# Altium schematic sheet SPI LVDS Peripheral.SchDoc: SPI LVDS Peripheral Board
size 279 x 215 mm; Engineer: JGao; Organization: TESLA Motors, INC; Address1: 3500 Deer Creek Road; Address2: Palo Alto, CA; Address4: U.S.A.; SheetNumber: 1; SheetTotal: 1
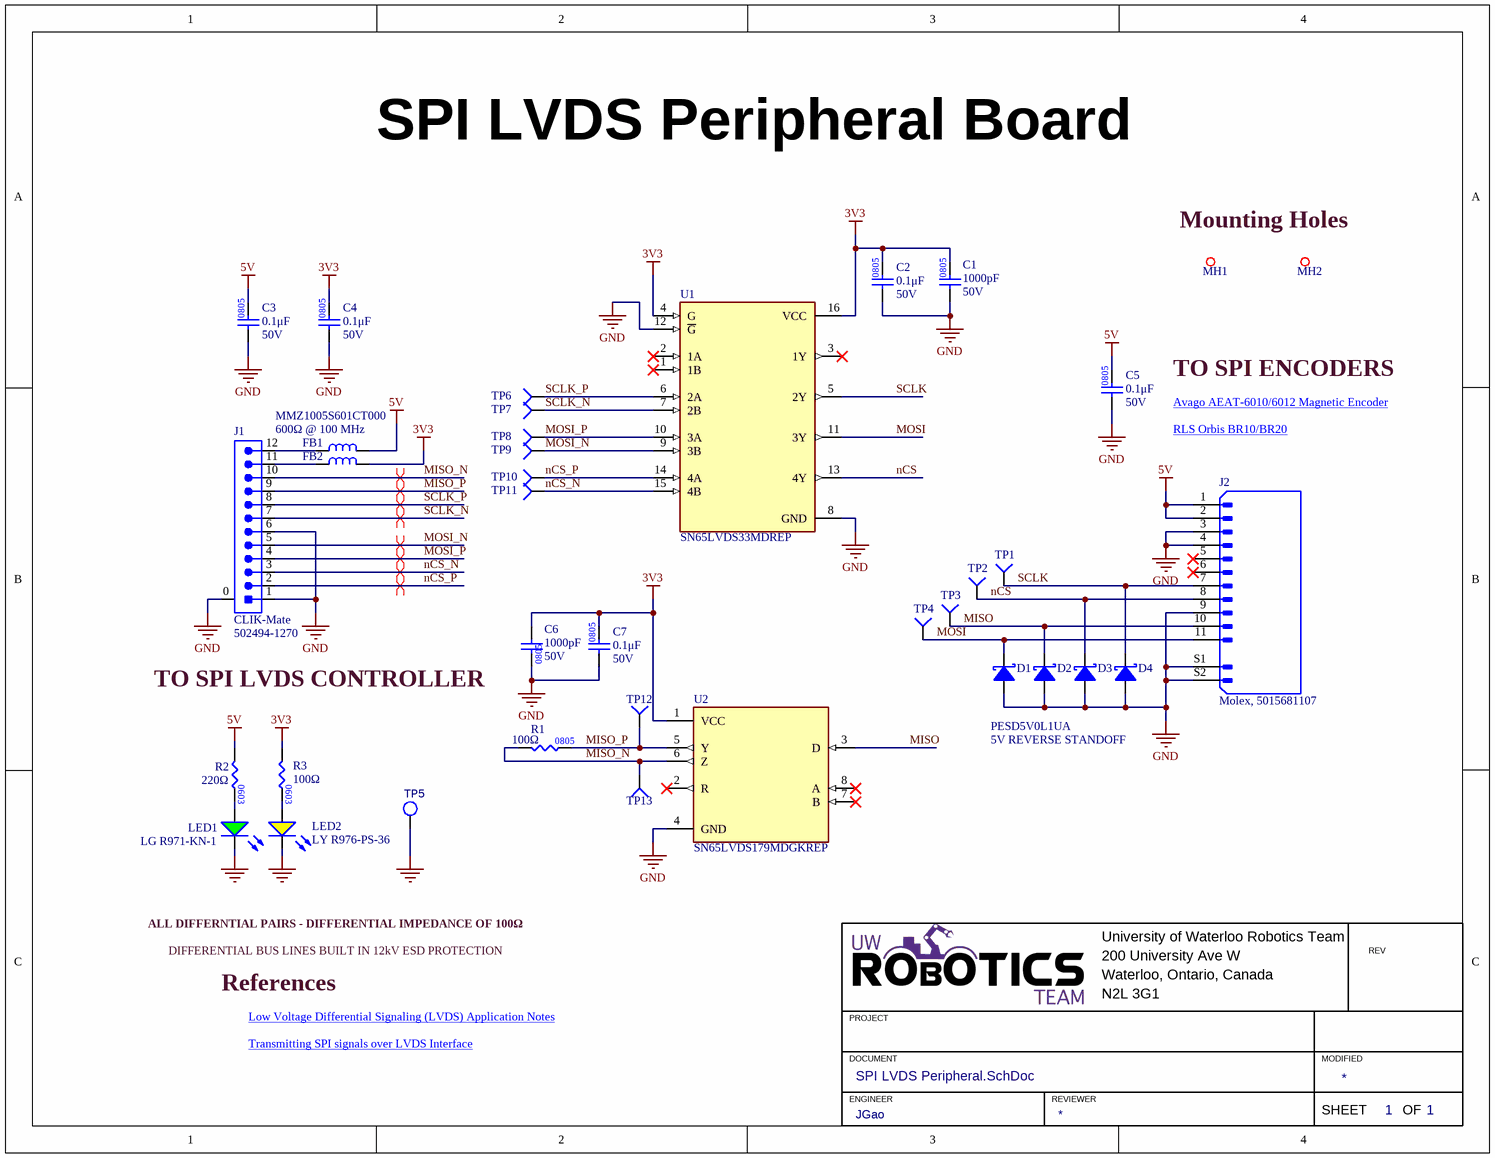
[diagram p0: SPI LVDS Peripheral.SchDoc]

## Parts
C1  value 1000pF  Voltage Rating: 50V  [CAP2012]  (hidden comment: CAP_1000pF_50V_0805)
C2  value 0.1μF  Voltage Rating: 50V  [CAP2012]  (hidden comment: CAP_0.1uF_50V_0805)
C3  value 0.1μF  Voltage Rating: 50V  [CAP2012]  (hidden comment: CAP_0.1uF_50V_0805)
C4  value 0.1μF  Voltage Rating: 50V  [CAP2012]  (hidden comment: CAP_0.1uF_50V_0805)
C5  value 0.1μF  Voltage Rating: 50V  [CAP2012]  (hidden comment: CAP_0.1uF_50V_0805)
C6  value 1000pF  Voltage Rating: 50V  [CAP2012]  (hidden comment: CAP_1000pF_50V_0805)
C7  value 0.1μF  Voltage Rating: 50V  [CAP2012]  (hidden comment: CAP_0.1uF_50V_0805)
D1  Manufacturer Part Number 1: PESD5V0L1UA  [SOD-323]  (hidden comment: TVS_DIODE_UNIDIR_5V)
D2  TVS_DIODE_UNIDIR_5V  [SOD-323]  (value not drawn)
D3  TVS_DIODE_UNIDIR_5V  [SOD-323]  (value not drawn)
D4  TVS_DIODE_UNIDIR_5V  [SOD-323]  (value not drawn)
FB1  Manufacturer Part Number 1: MMZ1005S601CT000  Impedance @ Frequency: 600Ω @ 100 MHz  [RES0402]  (hidden comment: FERRITE_BEAD_600OHM_0402)
FB2  FERRITE_BEAD_600OHM_0402  [RES0402]  (value not drawn)
J1  Family: CLIK-Mate  Supplier Part Number 1: 502494-1270  [MOLEX-5024941270]  (hidden comment: CON_12M_SM_RA_2mm)
J2  MP: Molex, 5015681107  [MOLEX-5015681107]  (hidden comment: CON_12M_SM_RA)
LED1  Manufacturer Part Number 1: LG R971-KN-1  [LED_0805_GREEN]  (hidden comment: LED_GREEN)
LED2  Manufacturer Part Number 1: LY R976-PS-36  [LED_0805_YELLOW]  (hidden comment: LED_YELLOW)
MH1  MOUNTING_HOLE_M3  [MOUNTING_HOLE_3mm]  (value not drawn)  (no BOM)
MH2  MOUNTING_HOLE_M3  [MOUNTING_HOLE_3mm]  (value not drawn)  (no BOM)
R1  value 100Ω  [RES0805]  (hidden comment: RES_100Ω_0805_1%)
R2  value 220Ω  [RES0603]  (hidden comment: RES_220Ω_0603_5%)
R3  value 100Ω  [RES0603]  (hidden comment: RES_100Ω_0603_1%)
TP1  TESTPOINT_1MM_SQUARE  [TESTPOINT_SQUARE_1MM]  (value not drawn)  (no BOM)
TP2  TESTPOINT_1MM_SQUARE  [TESTPOINT_SQUARE_1MM]  (value not drawn)  (no BOM)
TP3  TESTPOINT_1MM_SQUARE  [TESTPOINT_SQUARE_1MM]  (value not drawn)  (no BOM)
TP4  TESTPOINT_1MM_SQUARE  [TESTPOINT_SQUARE_1MM]  (value not drawn)  (no BOM)
TP5  TESTPOINT_LOOP  [TESTPOINT_LOOP]  (value not drawn)
TP6  TESTPOINT_1MM_CIRCLE  [TESTPOINT_CIRCLE_1MM]  (value not drawn)  (no BOM)
TP7  TESTPOINT_1MM_CIRCLE  [TESTPOINT_CIRCLE_1MM]  (value not drawn)  (no BOM)
TP8  TESTPOINT_1MM_CIRCLE  [TESTPOINT_CIRCLE_1MM]  (value not drawn)  (no BOM)
TP9  TESTPOINT_1MM_CIRCLE  [TESTPOINT_CIRCLE_1MM]  (value not drawn)  (no BOM)
TP10  TESTPOINT_1MM_CIRCLE  [TESTPOINT_CIRCLE_1MM]  (value not drawn)  (no BOM)
TP11  TESTPOINT_1MM_CIRCLE  [TESTPOINT_CIRCLE_1MM]  (value not drawn)  (no BOM)
TP12  TESTPOINT_1MM_CIRCLE  [TESTPOINT_CIRCLE_1MM]  (value not drawn)  (no BOM)
TP13  TESTPOINT_1MM_CIRCLE  [TESTPOINT_CIRCLE_1MM]  (value not drawn)  (no BOM)
U1  SN65LVDS33MDREP  [SOIC127P600X175-16N]
U2  SN65LVDS179MDGKREP  [SOP65P490X110-8N]

## Nets
3V3: C1.2 C2.2 C4.2 C6.2 C7.2 FB2.1 R3.1 U1.4(G) U1.16(VCC) U2.1(VCC)
5V: C3.2 C5.2 FB1.1 J2.1 J2.2 R2.1
GND: C1.1 C2.1 C3.1 C4.1 C5.1 C6.1 C7.1 D1.1(Anode) D2.1(Anode) D3.1(Anode) D4.1(Anode) J1.0 J1.1 J1.6 J2.3 J2.4 J2.9 J2.S1(SHIELD1) J2.S2(SHIELD2) LED1.2(K) LED2.2(K) TP5.1 U1.8(GND) U1.12(~{G}) U2.4(GND)
MISO: D2.2(Cathode) J2.10 TP3.1(=value) U2.3(D)
MISO_N: J1.10 R1.1 TP13.1(=value) U2.6(Z)
MISO_P: J1.9 R1.2 TP12.1(=value) U2.5(Y)
MOSI: D1.2(Cathode) J2.11 TP4.1(=value) U1.11(3Y)
MOSI_N: J1.5 TP9.1(=value) U1.9(3B)
MOSI_P: J1.4 TP8.1(=value) U1.10(3A)
nCS: D3.2(Cathode) J2.8 TP2.1(=value) U1.13(4Y)
nCS_N: J1.3 TP11.1(=value) U1.15(4B)
nCS_P: J1.2 TP10.1(=value) U1.14(4A)
SCLK: D4.2(Cathode) J2.7 TP1.1(=value) U1.5(2Y)
SCLK_N: J1.7 TP7.1(=value) U1.7(2B)
SCLK_P: J1.8 TP6.1(=value) U1.6(2A)
NetFB1_2: FB1.2 J1.12
NetFB2_2: FB2.2 J1.11
NetLED1_1: LED1.1(A) R2.2
NetLED2_1: LED2.1(A) R3.2

Not connected (* = marked no-connect by the designer): J2 5* 6*; U1 1(1B)* 2(1A)* 3(1Y)*; U2 2(R)* 7(B)* 8(A)*

## Layout directives
differential pair: MISO_N, MISO_P, MOSI_N, MOSI_P, nCS_N, nCS_P, SCLK_N, SCLK_P

## Notes on the sheet
- Mounting Holes
- TO SPI ENCODERS
- Avago AEAT-6010/6012 Magnetic Encoder <https://www.mouser.ca/datasheet/2/678/av02_0188en-1855336.pdf>
- RLS Orbis BR10/BR20 <https://www.rls.si/eng/fileuploader/download/download/?d=1&file=custom%2Fupload%2FBRD01_08_EN_data_sheet.pdf>
- TO SPI LVDS CONTROLLER
- 5V REVERSE STANDOFF
- ALL DIFFERNTIAL PAIRS - DIFFERENTIAL IMPEDANCE OF 100Ω
- DIFFERENTIAL BUS LINES BUILT IN 12kV ESD PROTECTION
- References
- Low Voltage Differential Signaling (LVDS) Application Notes <https://www.ti.com/lit/an/slla014a/slla014a.pdf?ts=1641520445544>
- Transmitting SPI signals over LVDS Interface <https://www.ti.com/lit/ug/tidued8/tidued8.pdf?ts=1641492246613>
- University of Waterloo Robotics Team
- 200 University Ave W
- REV
- PROJECT
- Waterloo, Ontario, Canada
- N2L 3G1
- DOCUMENT
- ENGINEER
- REVIEWER
- MODIFIED
- SHEET
- OF
- (in symbol RES_100Ω_0603_1%) 0603

## Library data of the parts
C1 C6 = CAP_1000pF_50V_0805: CAP CER 1000pF 50V X7R 0805; Manufacturer 1: Samsung; Manufacturer Part Number 1: CL21B102KBANNNC; Package/Footprint: 0805; Supplier 1: Digi-Key; Mounting Type: SMD; Supplier Part Number 1: 1276-1020-1-ND; Dielectric: X7R
C2-C5 C7 = CAP_0.1uF_50V_0805: CAP CER 0.1UF 50V X7R 0805; Manufacturer 1: KEMET; Manufacturer Part Number 1: C0805C104K5RAC7411; Package/Footprint: 0805; Mounting Type: SMD; Supplier 1: Mouser; Supplier Part Number 1: 80-C0805C104K5RACLR; Dielectric: X7R; LCSC Part #: C49678
D1 = TVS_DIODE_UNIDIR_5V: TVS DIODE 5VWM 12VC SOD-323-2; Manufacturer 1: Nexperia; Min Breakdown Voltage: 6.8 V; Clamping Voltage-Max: 12V; Supplier 1: Mouser; Supplier Part Number 1: 771-PESD5V0L1UA115
D2-D4 = TVS_DIODE_UNIDIR_5V: TVS DIODE 5VWM 12VC SOD-323-2; Manufacturer 1: Nexperia; Manufacturer Part Number 1: PESD5V0L1UA; Min Breakdown Voltage: 6.8 V; Clamping Voltage-Max: 12V; Supplier 1: Mouser; Supplier Part Number 1: 771-PESD5V0L1UA115
FB1 = FERRITE_BEAD_600OHM_0402: FIXED IND 1UH 3.8A 33 MOHM SMD; Manufacturer 1: TDK Corporation; DC Resistance (DCR) (Max): 520mΩ; Current Rating (Max): 300mA; Impedance: 600Ω; Supplier Part Number 1: 445-2162-1-ND; Supplier 1: Digi-Key; Mounting Type: SMD; Package/Footprint: SMD; Package: 0402
FB2 = FERRITE_BEAD_600OHM_0402: FIXED IND 1UH 3.8A 33 MOHM SMD; Manufacturer 1: TDK Corporation; Manufacturer Part Number 1: MMZ1005S601CT000; DC Resistance (DCR) (Max): 520mΩ; Current Rating (Max): 300mA; Impedance @ Frequency: 600Ω @ 100 MHz; Impedance: 600Ω; Supplier Part Number 1: 445-2162-1-ND; Supplier 1: Digi-Key; Mounting Type: SMD; Package/Footprint: SMD; Package: 0402
J1 = CON_12M_SM_RA_2mm: 2.00mm Pitch CLIK-Mate Wire-to-Board PCB Receptacle, Single Row, Right-Angle, 12 Circuits; Manufacturer: Molex; Number of Contacts: 12; Contact Resistance: 20mR; Current Rating: 3A; Mating Cycles: 30; Voltage Rating (AC): 250V; Insulation Resistance: 1GR; Pitch: 2mm; Glow Wire Compliant: Non-compliant; Supplier 1: Mouser; Manufacturer Part Number: 502494-1270; RoHS: Yes; Category: Headers and Wire Housings; Stock 1: 1900; Pricing 1: 950=0.62780, 1900=0.61060, 3800=0.56580, 5700=0.53600, 7600=0.52000 (USD); Mount: Surface Mount; Color: Natural,White; Contact Plating: Tin; Contact Material: Copper Alloy; Housing Material: PBT; Material: Polybutylene; Housing Color: Natural; Min Operating Temperature: -25°C; Max Operating Temperature: 85°C; Number of Rows: 1; Termination: Solder; Fastening Type: Latch; Packaging: Tape and Reel; Contact Gender: Female; Package Quantity: 950; Connector Type: Receptacle; Number of Positions: 12; Max Voltage Rating (AC): 250V; Max Voltage Rating (DC): 250V; Gender: Receptacle; Orientation: Right Angle; Number of Circuits: 12; Series: 502494; Contact Type: Center Strip Contact; Length: 28mm; Lead Pitch: 2mm; Depth: 6.85mm; Radiation Hardening: No; REACH SVHC: Unknown; Flammability Rating: UL94 V-0
J2 = CON_11M_SM_RA: CONN HEADER SMD RIGHT ANGLE 1MM PITCH; Availability: Unavailable; Value: *; Package: None; Price: None; Supplier 1: Digi-Key; Supplier Part Number 1: WM7902CT-ND
LED1 = LED_GREEN: LED GREEN DIFFUSED 0805 SMD; Manufacturer 1: OSRAM; Forward Voltage Drop: 2.2V; Package/Footprint: 0805; Supplier Part Number 1: 475-1410-1-ND; Supplier 1: Digi-Key; Mounting Type: SMD
LED2 = LED_YELLOW: LED YELLOW DIFFUSED 0805 SMD; Manufacturer 1: OSRAM; Forward Voltage Drop: 2.2V; Package: 0805 (2012 Metric); Supplier Part Number 1: 475-2560-1-ND; Supplier 1: Digi-Key
R1 = RES_100Ω_0805_1%: RES 100 OHM 1% 1/8W 0805; Manufacturer 1: ROHM Semiconductor; Manufacturer Part Number 1: SFR10EZPF1000; Package/Footprint: 0805; Supplier 1: Mouser; Mounting Type: SMD; Supplier Part Number 1: 755-SFR10EZPF1000; LCSC Part #: C1790
R2 = RES_220Ω_0603_5%: RES 220 OHM 5% 1/10W 0603; Manufacturer 1: Yageo; Manufacturer Part Number 1: AC0603JR-07220RL; Package/Footprint: 0603; Supplier Part Number 1: YAG3652CT-ND; Supplier 1: Digi-Key
R3 = RES_100Ω_0603_1%: RES 100 OHM 1% 1/10W 0603; Manufacturer 1: Yageo; Manufacturer Part Number 1: RC0603FR-07100RL; Supplier Part Number 1: 311-100HRCT-ND; Supplier 1: Digi-Key
TP1-TP4 = TESTPOINT_1MM_SQUARE: TESTPOINT 1MM SQUARE
TP5 = TESTPOINT_LOOP: TESTPOINT THRUHOLE; Manufacturer 1: Keystone Electronics; Manufacturer Part Number 1: 5002; Package/Footprint: TH; Supplier Part Number 1: 36-5002-ND; Supplier 1: Digi-Key; Mounting Type: TH
TP6-TP13 = TESTPOINT_1MM_CIRCLE: TESTPOINT 1MM CIRCLE
U1 = SN65LVDS33MDREP: IC RECEIVER 0/4 16SOIC; Package: None; Price: None; Value: *; MP: SN65LVDS33MDREP; Availability: Unavailable; Supplier 1: Digi-Key; Supplier Part Number 1: 296-19498-1-ND
U2 = SN65LVDS179MDGKREP: Enhanced Product High-Speed Differential Line Drivers And Receivers 8-VSSOP -55 to 125; MF: Texas Instruments; Package: VSSOP-8 Texas Instruments; Purchase-URL: https://pricing.snapeda.com/search/part/SN65LVDS179MDGKREP/?ref=eda; Digi-Key_Part_Number: 296-22243-1-ND; Value: *; SnapEDA_Link: https://www.snapeda.com/parts/SN65LVDS179MDGKREP/Texas%20Instruments/view-part/383554/?ref=snap; MP: SN65LVDS179MDGKREP; Supplier 1: Digi-Key; Supplier Part Number 1: 296-22243-1-ND